# Altium schematic sheet Processor.SchDoc
size A4; Author: Michał Wojna; CompanyName: AGH; Revision: 1; ProjectName: Lab. Proj. PCB
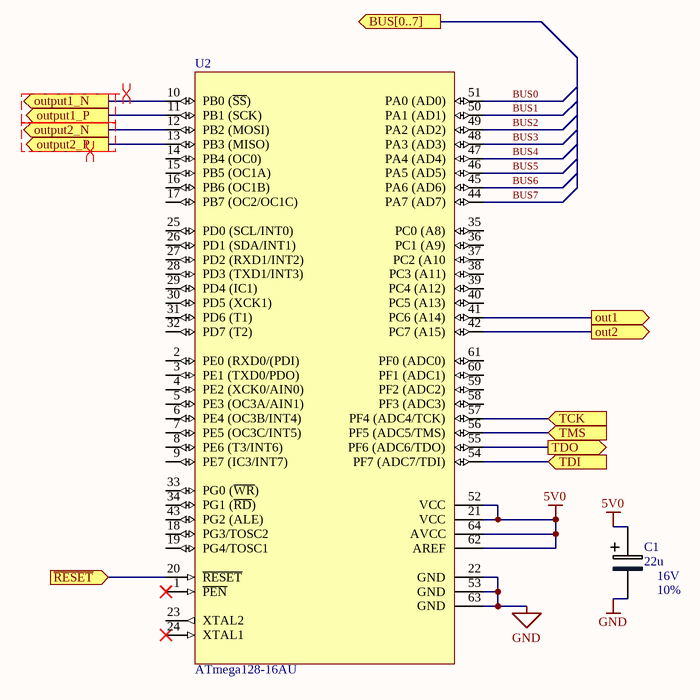
[diagram p0: Processor.SchDoc]

## Parts
C1  22u  Rated Voltage: 16V  Tolerance: 10%  [VJ_Tantalum_A]
U2  ATmega128-16AU  [64A_N]

## Ports
BUS[0..7] (out), out1 (out), out2 (out), output1_N (out), output1_P (out), output2_N (out), output2_P (out), TCK (in), TDI (in), TDO (out), TMS (in), ~{RESET} (in)

## Nets
5V0: C1.1 U2.21(VCC) U2.52(VCC) U2.62(AREF) U2.64(AVCC)
GND: C1.2 U2.22(GND) U2.53(GND) U2.63(GND)
BUS0: U2.51(PA0_(AD0))
BUS1: U2.50(PA1_(AD1))
BUS2: U2.49(PA2_(AD2))
BUS3: U2.48(PA3_(AD3))
BUS4: U2.47(PA4_(AD4))
BUS5: U2.46(PA5_(AD5))
BUS6: U2.45(PA6_(AD6))
BUS7: U2.44(PA7_(AD7))
out1: U2.41(PC6_(A14)) ; port out1
out2: U2.42(PC7_(A15)) ; port out2
output1_N: U2.10(PB0_(~{SS})) ; port output1_N
output1_P: U2.11(PB1_(SCK)) ; port output1_P
output2_N: U2.12(PB2_(MOSI)) ; port output2_N
output2_P: U2.13(PB3_(MISO)) ; port output2_P
~{RESET}: U2.20(~{RESET}) ; port ~{RESET}
TCK: U2.57(PF4_(ADC4/TCK)) ; port TCK
TDI: U2.54(PF7_(ADC7/TDI)) ; port TDI
TDO: U2.55(PF6_(ADC6/TDO)) ; port TDO
TMS: U2.56(PF5_(ADC5/TMS)) ; port TMS

Not connected (* = marked no-connect by the designer): U2 1(~{PEN})* 2(PE0_(RXD0/(PDI)) 3(PE1_(TXD0/PDO)) 4(PE2_(XCK0/AIN0)) 5(PE3_(OC3A/AIN1)) 6(PE4_(OC3B/INT4)) 7(PE5_(OC3C/INT5)) 8(PE6_(T3/INT6)) 9(PE7_(IC3/INT7)) 14(PB4_(OC0)) 15(PB5_(OC1A)) 16(PB6_(OC1B)) 17(PB7_(OC2/OC1C)) 18(PG3/TOSC2) 19(PG4/TOSC1) 23(XTAL2) 24(XTAL1)* 25(PD0_(SCL/INT0)) 26(PD1_(SDA/INT1)) 27(PD2_(RXD1/INT2)) 28(PD3_(TXD1/INT3)) 29(PD4_(IC1)) 30(PD5_(XCK1)) 31(PD6_(T1)) 32(PD7_(T2)) 33(PG0_(~{WR})) 34(PG1_(~{RD})) 35(PC0_(A8)) 36(PC1_(A9)) 37(PC2_(A10) 38(PC3_(A11)) 39(PC4_(A12)) 40(PC5_(A13)) 43(PG2_(ALE)) 58(PF3_(ADC3)) 59(PF2_(ADC2)) 60(PF1_(ADC1)) 61(PF0_(ADC0))

## Layout directives
differential pair: (no net found under the mark)

## Notes on the sheet
- Company Confidential / Not for distribution !
- Project name:
- Document Name:
- Designer Name:
- Date / Time:
- Revision:

## Library data of the parts
C1 = Capacitor_polarized: Manufacturer: VJ; Part Number: 293D223X9016D2TE3; Vendor: Farnell; Value: 22u; HelpURL: *; Vendor Number: *
U2 = ATmega128-16AU: 8-bit AVR Microcontroller, 4.5-5.5V, 128KB Flash, 4KB EEPROM, 4KB SRAM, 64-pin TQFP, Industrial Grade (-40°C to 85°C); DatasheetVersion: revX, Jun-2011; PackageVersion: revC, Oct-2010; PackageReference: 64A; PackageDescription: 64-Pin Plastic Thin Profile Quad Flat Pack, 14 x 14 x 1.0 mm Body, 0.8 mm Pitch (TQFP); Code_JEDEC: MS-026-AEB; ComponentLink1Description: Manufacturer URL; ComponentLink1URL: http://www.atmel.com/; ComponentLink2Description: ATmega128(L) Datasheet; ComponentLink2URL: http://www.atmel.com/dyn/resources/prod_documents/doc2467.pdf; ComponentLink3Description: ATmega128(L) Summary; ComponentLink3URL: http://www.atmel.com/dyn/resources/prod_documents/2467S.pdf